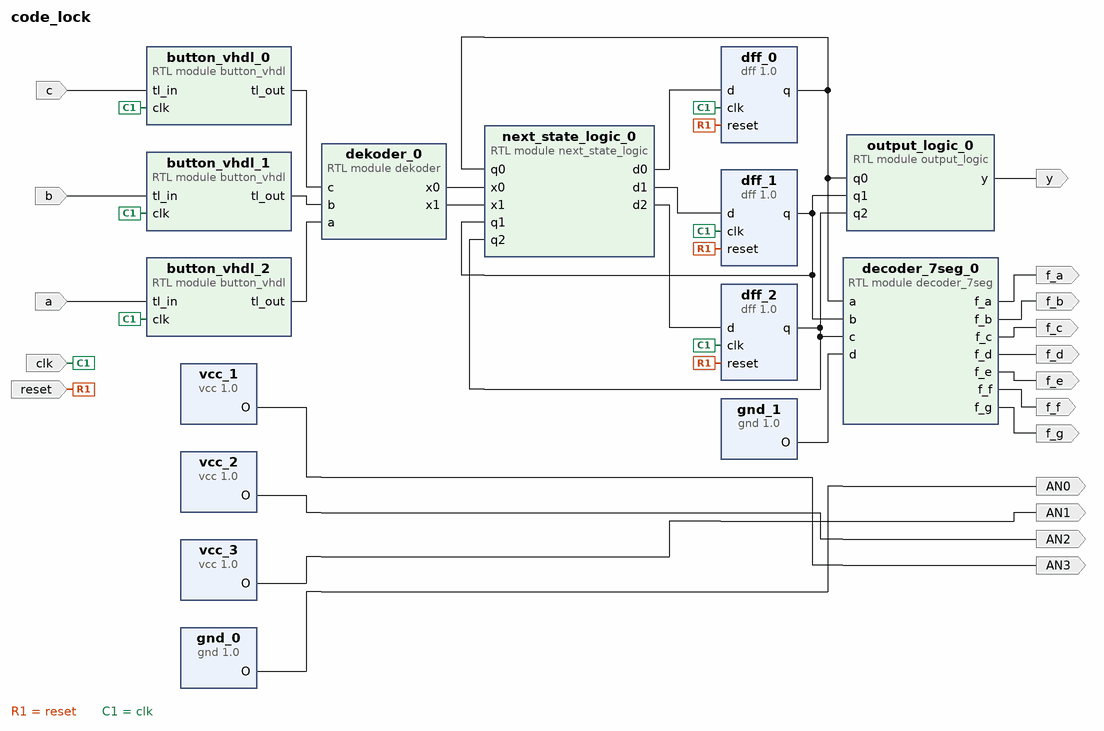
[diagram p0: block diagram of the top level]
# Vivado block design code_lock, xc7a35tcpg236-1, Vivado 2018.2.1
create_bd_design code_lock

create_bd_port -dir O y
create_bd_port -dir I -type rst reset
set_property -dict {CONFIG.POLARITY ACTIVE_HIGH} [get_bd_ports reset]
create_bd_port -dir O f_a
create_bd_port -dir O f_b
create_bd_port -dir O f_c
create_bd_port -dir O f_d
create_bd_port -dir O f_e
create_bd_port -dir O f_f
create_bd_port -dir O f_g
create_bd_port -dir I clk
create_bd_port -dir I a
create_bd_port -dir I b
create_bd_port -dir I c
create_bd_port -dir O AN3
create_bd_port -dir O AN2
create_bd_port -dir O AN1
create_bd_port -dir O AN0

create_bd_cell -type module -reference next_state_logic next_state_logic_0
create_bd_cell -type ip -vlnv FIT:user:dff:1.0 dff_0
create_bd_cell -type ip -vlnv FIT:user:dff:1.0 dff_1
create_bd_cell -type ip -vlnv FIT:user:dff:1.0 dff_2
create_bd_cell -type module -reference output_logic output_logic_0
create_bd_cell -type module -reference button_vhdl button_vhdl_1
create_bd_cell -type module -reference button_vhdl button_vhdl_2
create_bd_cell -type module -reference button_vhdl button_vhdl_0
create_bd_cell -type ip -vlnv FIT:user:gnd:1.0 gnd_0
create_bd_cell -type ip -vlnv FIT:user:vcc:1.0 vcc_1
create_bd_cell -type ip -vlnv FIT:user:vcc:1.0 vcc_2
create_bd_cell -type ip -vlnv FIT:user:vcc:1.0 vcc_3
create_bd_cell -type module -reference decoder_7seg decoder_7seg_0
create_bd_cell -type ip -vlnv FIT:user:gnd:1.0 gnd_1
create_bd_cell -type module -reference dekoder dekoder_0

# ---- connections ----

connect_bd_net [get_bd_pins dekoder_0/x0] [get_bd_pins next_state_logic_0/x0]
connect_bd_net [get_bd_pins dekoder_0/x1] [get_bd_pins next_state_logic_0/x1]
connect_bd_net [get_bd_pins dff_0/q] [get_bd_pins next_state_logic_0/q0] [get_bd_pins output_logic_0/q0] [get_bd_pins decoder_7seg_0/a]
connect_bd_net [get_bd_pins dff_1/q] [get_bd_pins next_state_logic_0/q1] [get_bd_pins output_logic_0/q1] [get_bd_pins decoder_7seg_0/b]
connect_bd_net [get_bd_pins dff_2/q] [get_bd_pins next_state_logic_0/q2] [get_bd_pins output_logic_0/q2] [get_bd_pins decoder_7seg_0/c]
connect_bd_net [get_bd_pins output_logic_0/y] [get_bd_ports y]
connect_bd_net [get_bd_pins next_state_logic_0/d0] [get_bd_pins dff_0/d]
connect_bd_net [get_bd_pins next_state_logic_0/d1] [get_bd_pins dff_1/d]
connect_bd_net [get_bd_pins next_state_logic_0/d2] [get_bd_pins dff_2/d]
connect_bd_net [get_bd_ports reset] [get_bd_pins dff_2/reset] [get_bd_pins dff_1/reset] [get_bd_pins dff_0/reset]
connect_bd_net [get_bd_pins decoder_7seg_0/f_a] [get_bd_ports f_a]
connect_bd_net [get_bd_pins decoder_7seg_0/f_b] [get_bd_ports f_b]
connect_bd_net [get_bd_pins decoder_7seg_0/f_c] [get_bd_ports f_c]
connect_bd_net [get_bd_pins decoder_7seg_0/f_d] [get_bd_ports f_d]
connect_bd_net [get_bd_pins decoder_7seg_0/f_e] [get_bd_ports f_e]
connect_bd_net [get_bd_pins decoder_7seg_0/f_f] [get_bd_ports f_f]
connect_bd_net [get_bd_pins decoder_7seg_0/f_g] [get_bd_ports f_g]
connect_bd_net [get_bd_ports clk] \
  [get_bd_pins dff_0/clk] [get_bd_pins dff_1/clk] [get_bd_pins dff_2/clk] [get_bd_pins button_vhdl_1/clk] \
  [get_bd_pins button_vhdl_2/clk] [get_bd_pins button_vhdl_0/clk]
connect_bd_net [get_bd_ports a] [get_bd_pins button_vhdl_2/tl_in]
connect_bd_net [get_bd_ports b] [get_bd_pins button_vhdl_1/tl_in]
connect_bd_net [get_bd_ports c] [get_bd_pins button_vhdl_0/tl_in]
connect_bd_net [get_bd_pins button_vhdl_0/tl_out] [get_bd_pins dekoder_0/c]
connect_bd_net [get_bd_pins button_vhdl_1/tl_out] [get_bd_pins dekoder_0/b]
connect_bd_net [get_bd_pins button_vhdl_2/tl_out] [get_bd_pins dekoder_0/a]
connect_bd_net [get_bd_pins vcc_1/O] [get_bd_ports AN3]
connect_bd_net [get_bd_pins vcc_2/O] [get_bd_ports AN2]
connect_bd_net [get_bd_pins vcc_3/O] [get_bd_ports AN1]
connect_bd_net [get_bd_pins gnd_0/O] [get_bd_ports AN0]
connect_bd_net [get_bd_pins gnd_1/O] [get_bd_pins decoder_7seg_0/d]

validate_bd_design
save_bd_design
